# Altium schematic sheet MainControllerPower.SchDoc: =ProjectTitle
size B; Engineer: H. Collector; Organization: IMR Engineering; Address1: 3621 Gin Way; Address2: Snellville, GA 30039; Address3: USA; SheetNumber: 3; SheetTotal: 10
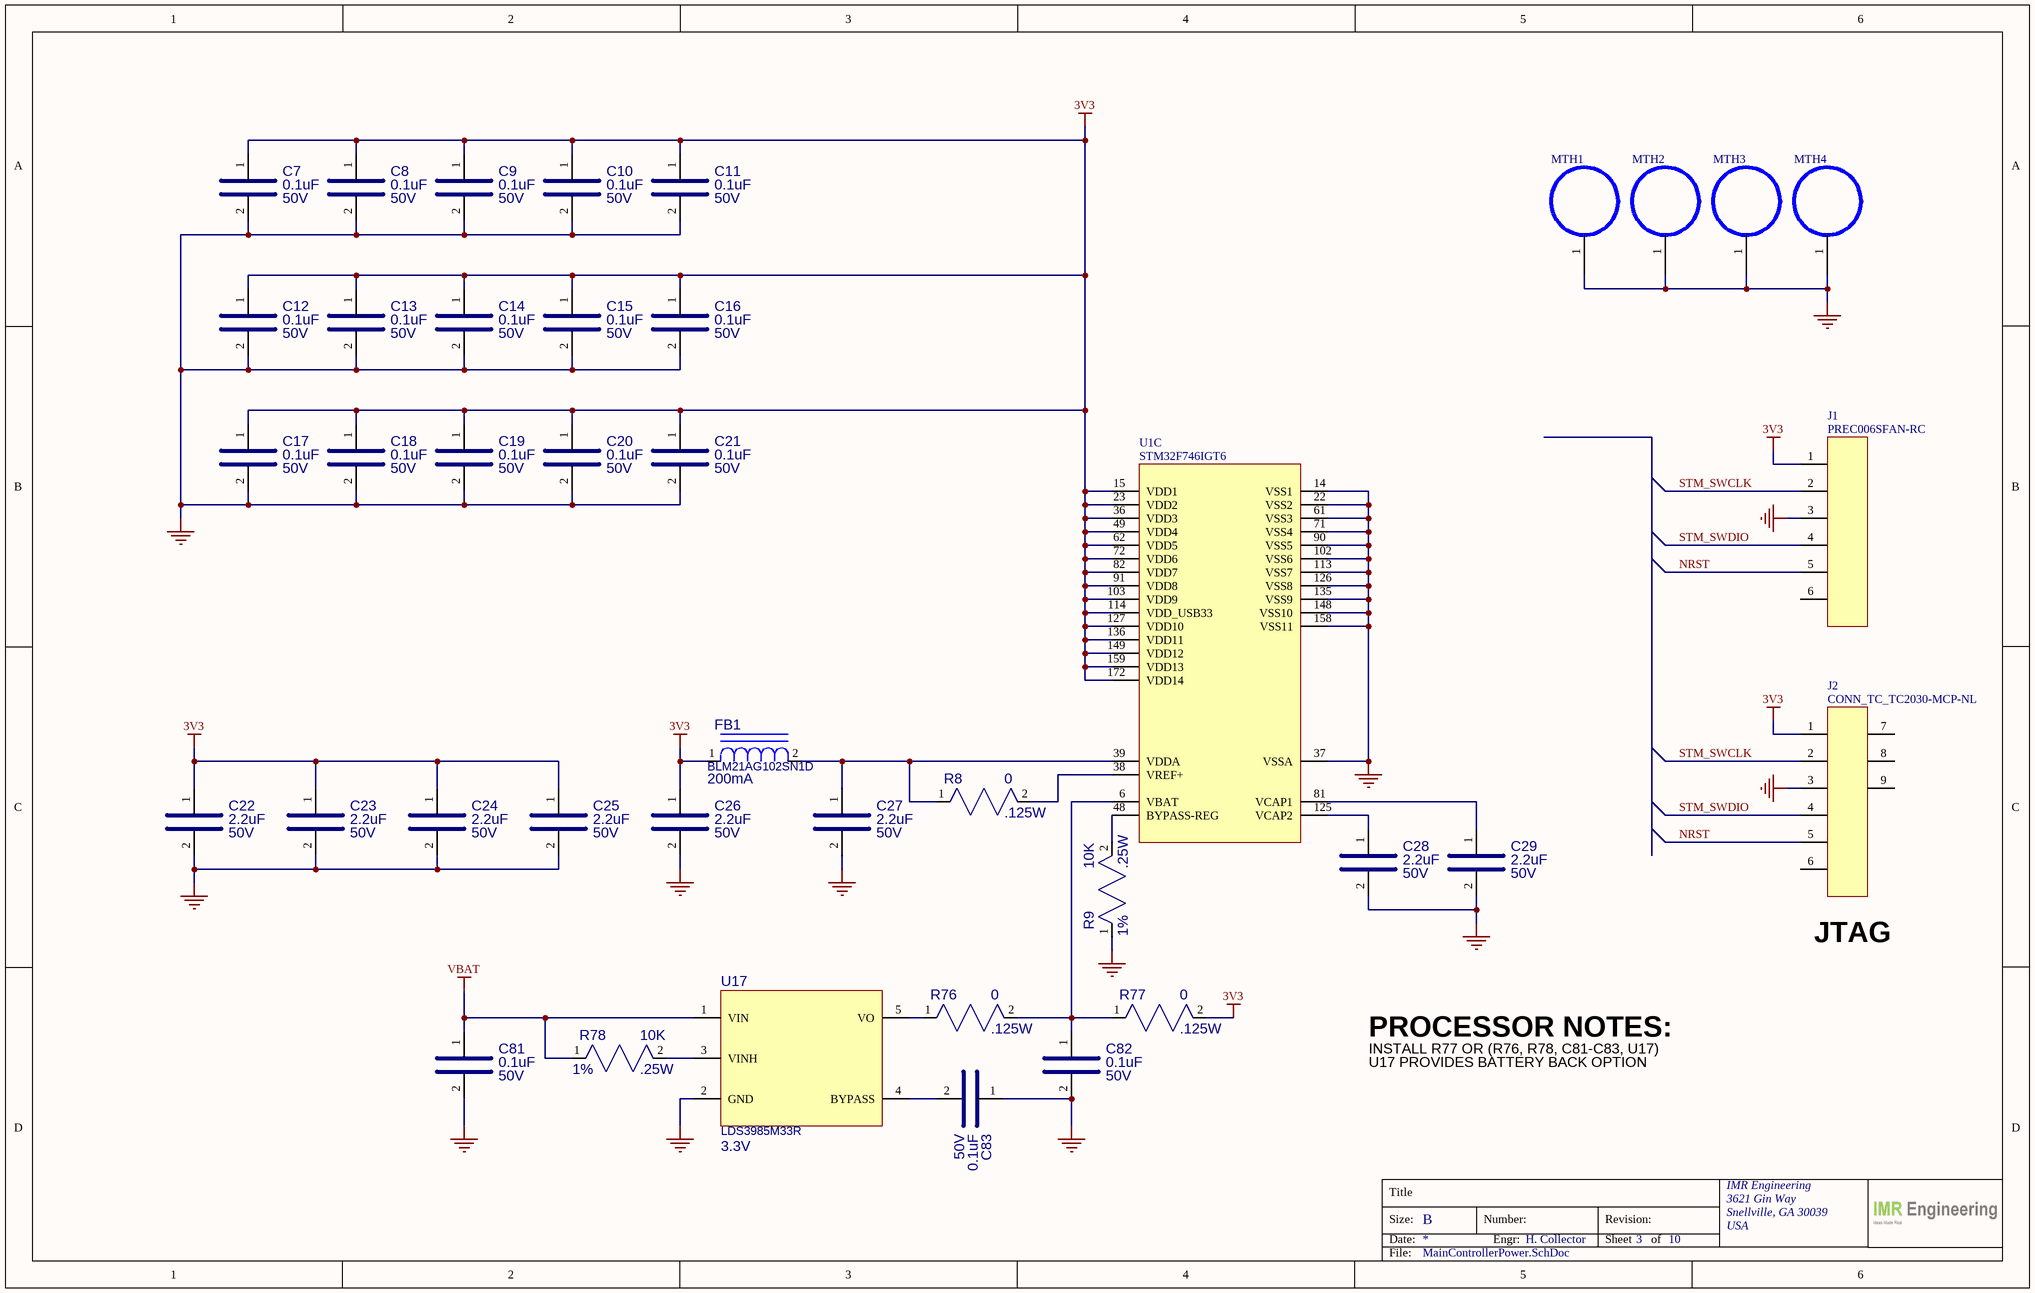
[diagram p0: MainControllerPower.SchDoc]

## Parts
C7  value 0.1uF  VOLTAGE: 50V  [CAP_0603]  (hidden comment: CC0603KRX7R9BB104)
C8  value 0.1uF  VOLTAGE: 50V  [CAP_0603]  (hidden comment: CC0603KRX7R9BB104)
C9  value 0.1uF  VOLTAGE: 50V  [CAP_0603]  (hidden comment: CC0603KRX7R9BB104)
C10  value 0.1uF  VOLTAGE: 50V  [CAP_0603]  (hidden comment: CC0603KRX7R9BB104)
C11  value 0.1uF  VOLTAGE: 50V  [CAP_0603]  (hidden comment: CC0603KRX7R9BB104)
C12  value 0.1uF  VOLTAGE: 50V  [CAP_0603]  (hidden comment: CC0603KRX7R9BB104)
C13  value 0.1uF  VOLTAGE: 50V  [CAP_0603]  (hidden comment: CC0603KRX7R9BB104)
C14  value 0.1uF  VOLTAGE: 50V  [CAP_0603]  (hidden comment: CC0603KRX7R9BB104)
C15  value 0.1uF  VOLTAGE: 50V  [CAP_0603]  (hidden comment: CC0603KRX7R9BB104)
C16  value 0.1uF  VOLTAGE: 50V  [CAP_0603]  (hidden comment: CC0603KRX7R9BB104)
C17  value 0.1uF  VOLTAGE: 50V  [CAP_0603]  (hidden comment: CC0603KRX7R9BB104)
C18  value 0.1uF  VOLTAGE: 50V  [CAP_0603]  (hidden comment: CC0603KRX7R9BB104)
C19  value 0.1uF  VOLTAGE: 50V  [CAP_0603]  (hidden comment: CC0603KRX7R9BB104)
C20  value 0.1uF  VOLTAGE: 50V  [CAP_0603]  (hidden comment: CC0603KRX7R9BB104)
C21  value 0.1uF  VOLTAGE: 50V  [CAP_0603]  (hidden comment: CC0603KRX7R9BB104)
C22  value 2.2uF  VOLTAGE: 50V  [CAP_0805]  (hidden comment: UMK212BB7225MG-T)
C23  value 2.2uF  VOLTAGE: 50V  [CAP_0805]  (hidden comment: UMK212BB7225MG-T)
C24  value 2.2uF  VOLTAGE: 50V  [CAP_0805]  (hidden comment: UMK212BB7225MG-T)
C25  value 2.2uF  VOLTAGE: 50V  [CAP_0805]  (hidden comment: UMK212BB7225MG-T)
C26  value 2.2uF  VOLTAGE: 50V  [CAP_0805]  (hidden comment: UMK212BB7225MG-T)
C27  value 2.2uF  VOLTAGE: 50V  [CAP_0805]  (hidden comment: UMK212BB7225MG-T)
C28  value 2.2uF  VOLTAGE: 50V  [CAP_0805]  (hidden comment: UMK212BB7225MG-T)
C29  value 2.2uF  VOLTAGE: 50V  [CAP_0805]  (hidden comment: UMK212BB7225MG-T)
C81  value 0.1uF  VOLTAGE: 50V  [CAP_0805]  (hidden comment: 08055C104KAT2A)
C82  value 0.1uF  VOLTAGE: 50V  [CAP_0805]  (hidden comment: 08055C104KAT2A)
C83  value 0.1uF  VOLTAGE: 50V  [CAP_0805]  (hidden comment: 08055C104KAT2A)
FB1  value 200mA  [RES_0805]  (hidden comment: BLM21AG102SN1D)
J1  PREC006SFAN-RC  [HDR_1X6_100MILL]
J2  CONN_TC_TC2030-MCP-NL  [TC2030-MCP-NL-]  (no BOM)
MTH1  MOUNT_HOLE_3MM_ID  [MT_HOLE_3MM_5MM]  (value not drawn)  (no BOM)
MTH2  MOUNT_HOLE_3MM_ID  [MT_HOLE_3MM_5MM]  (value not drawn)  (no BOM)
MTH3  MOUNT_HOLE_3MM_ID  [MT_HOLE_3MM_5MM]  (value not drawn)  (no BOM)
MTH4  MOUNT_HOLE_3MM_ID  [MT_HOLE_3MM_5MM]  (value not drawn)  (no BOM)
R8  value 0  POWER: .125W  [PMG_RES_0805]  (hidden comment: RC0805JR-070RL)
R9  value 10K  TOLERANCE: 1%  POWER: .25W  [RES_0805]  (hidden comment: SG73S2ATTD1002F)
R76  value 0  POWER: .125W  [PMG_RES_0805]  (hidden comment: RC0805JR-070RL)
R77  value 0  POWER: .125W  [PMG_RES_0805]  (hidden comment: RC0805JR-070RL)
R78  value 10K  TOLERANCE: 1%  POWER: .25W  [RES_0805]  (hidden comment: SG73S2ATTD1002F)
U1  STM32F746IGT6  [QFP50P2600X2600X160-176N]  (part C of 3)
U17  value 3.3V  [SOT23-5]  (hidden comment: LDS3985M33R)

## Nets
3V3: C7.1 C8.1 C9.1 C10.1 C11.1 C12.1 C13.1 C14.1 C15.1 C16.1 C17.1 C18.1 C19.1 C20.1 C21.1 C22.1 C23.1 C24.1 C25.1 C26.1 FB1.1 J1.1 J2.1 R77.2 U1.15(VDD1) U1.23(VDD2) U1.36(VDD3) U1.49(VDD4) U1.62(VDD5) U1.72(VDD6) U1.82(VDD7) U1.91(VDD8) U1.103(VDD9) U1.114(VDD_USB33) U1.127(VDD10) U1.136(VDD11) U1.149(VDD12) U1.159(VDD13) U1.172(VDD14)
GND: C7.2 C8.2 C9.2 C10.2 C11.2 C12.2 C13.2 C14.2 C15.2 C16.2 C17.2 C18.2 C19.2 C20.2 C21.2 C22.2 C23.2 C24.2 C25.2 C26.2 C27.2 C28.2 C29.2 C81.2 C82.2 C83.1 J1.3 J2.3 MTH1.1 MTH2.1 MTH3.1 MTH4.1 R9.1 U1.14(VSS1) U1.22(VSS2) U1.37(VSSA) U1.61(VSS3) U1.71(VSS4) U1.90(VSS5) U1.102(VSS6) U1.113(VSS7) U1.126(VSS8) U1.135(VSS9) U1.148(VSS10) U1.158(VSS11) U17.2(GND)
VBAT: C81.1 R78.1 U17.1(VIN)
NRST: J1.5 J2.5
STM_SWCLK: J1.2 J2.2
STM_SWDIO: J1.4 J2.4
NetC27_1: C27.1 FB1.2 R8.1 U1.39(VDDA)
NetC28_1: C28.1 U1.125(VCAP2)
NetC29_1: C29.1 U1.81(VCAP1)
NetC82_1: C82.1 R76.2 R77.1 U1.6(VBAT)
NetC83_2: C83.2 U17.4(BYPASS)
NetR8_2: R8.2 U1.38(VREF+)
NetR9_2: R9.2 U1.48(BYPASS-REG)
NetR76_1: R76.1 U17.5(VO)
NetR78_2: R78.2 U17.3(VINH)

Not connected (* = marked no-connect by the designer): J1 6; J2 6 7 8 9

## Notes on the sheet
- (near J2) JTAG
- PROCESSOR NOTES:
- INSTALL R77 OR (R76, R78, C81-C83, U17)
- U17 PROVIDES BATTERY BACK OPTION
- Title
- Size:
- Date:
- B
- Number:
- Engr:
- Revision:
- Sheet
- of
- File:

## Library data of the parts
C7-C21 = CAP_0.1UF_50V_0603: CAP CER 0.1UF 50V X7R 0603; MFG: Yageo; TOLERANCE: 10%; MFG_PN: CC0603KRX7R9BB104; Supplier 1: Digi-Key; Supplier Part Number 1: 311-1344-1-ND; Case/Package: 0603
C22-C29 = CAP_2.2UF_50V_0805: CAP CER 2.2UF 50V X7R 0805; MFG: Taiyo Yuden; TOLERANCE: 20%; MFG_PN: UMK212BB7225MG-T; Supplier 1: Digi-Key; Supplier Part Number 1: 587-4963-1-ND; Case/Package: 0805
C81-C83 = CAP_0.1UF_50V_0805: CAP CER 0.1UF 50V X7R 0805; MFG: AVX; TOLERANCE: 10%; MFG_PN: 08055C104KAT2A; Supplier 1: Digi-Key; Supplier Part Number 1: 478-1395-1-ND; Case/Package: 0805; ClassName: UI_UltraSonic
FB1 = FERRITE_BLM21AG102SN1D: FERRITE, 1KOHM AT 100MHZ, 220MA, .450DCR; MFG: MURATA; TOLERANCE: 10%; Supplier 1: Digi-Key; Supplier Part Number 1: 490-1041-1-ND; MFG_PN: BLM21AG102SN1D
J1 = CONN_6P_SINGLE_ROW: CONN HEADER VERT 6POS 2.54MM; MFG: Sullins Connector Solutions; Case/Package: 6P_2.54MM; MFG_PN: PREC006SFAN-RC; Supplier 1: Digi-Key; Supplier Part Number 1: S1212EC-06-ND; Value: *
J2 = CONN_TC_TC2030-MCP-NL: CABLE TAG-CONNECT IN-CIRCUIT; MFG: Tag-Connect LLC; Case/Package: *; MFG_PN: TC2030-MCP-NL; Supplier 1: Digi-Key; Supplier Part Number 1: TC2030-MCP-NLTC-ND; Value: *
MTH1-MTH4 = MOUNT_HOLE_3MM_ID: 3MM IN D. MT HOLE
R8 R76 R77 = RES_0_0805_1/8W: RES SMD 0 OHM JUMPER 1/8W 0805; MFG: Yageo; Case/Package: 0805; MFG_PN: RC0805JR-070RL; Supplier 1: Digi-Key; Supplier Part Number 1: 311-0.0ARCT-ND; TOLERANCE: JUMPER
R9 R78 = RES_10K_0805_1/4W_1%: RES SMD 10K OHM 1% 1/4W 0805; MFG: KOA Speer Electronics, Inc.; Case/Package: 0805; MFG_PN: SG73S2ATTD1002F; Supplier 1: Digi-Key; Supplier Part Number 1: 2019-SG73S2ATTD1002FCT-ND
U1 = IC_STM32F746NGH6U: STM32F746NGH6 (STM32F7 Birdie) TBGA216; MFG: STMicroelectronics; Value: 216MHz 1MB; Case/Package: 176LQFP; MFG_PN: STM32F746IGT6; Supplier 1: DigiKey; Supplier Part Number 1: 497-15817-ND
U17 = IC_LDS3985M33R: IC REG LINEAR 3.3V 300MA SOT23-5; MFG: STMicroelectronics; Supplier 1: Digi-Key; Supplier Part Number 1: 497-4257-1-ND; MFG_PN: LDS3985M33R